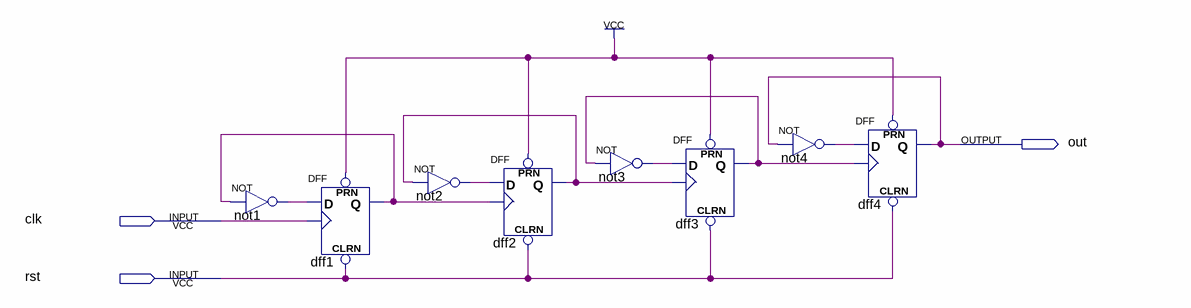
[diagram p0: schematic sheet]
// Quartus schematic 4ff.bdf as structural Verilog: 8 symbols, 3 pins
module \4ff  (
  input  clk,
  input  rst,
  output out
);

  wire dff1_q, dff2_q, dff3_q, not1_out, not2_out, not3_out, not4_out;

  not not1 (not1_out, dff1_q);
  DFF dff1 (.CLRN(rst), .CLK(clk), .D(not1_out), .PRN(1'b1), .Q(dff1_q));
  not not2 (not2_out, dff2_q);
  DFF dff2 (.CLRN(rst), .CLK(dff1_q), .D(not2_out), .PRN(1'b1), .Q(dff2_q));
  not not3 (not3_out, dff3_q);
  DFF dff3 (.CLRN(rst), .CLK(dff2_q), .D(not3_out), .PRN(1'b1), .Q(dff3_q));
  not not4 (not4_out, out);
  DFF dff4 (.CLRN(rst), .CLK(dff3_q), .D(not4_out), .PRN(1'b1), .Q(out));
endmodule
